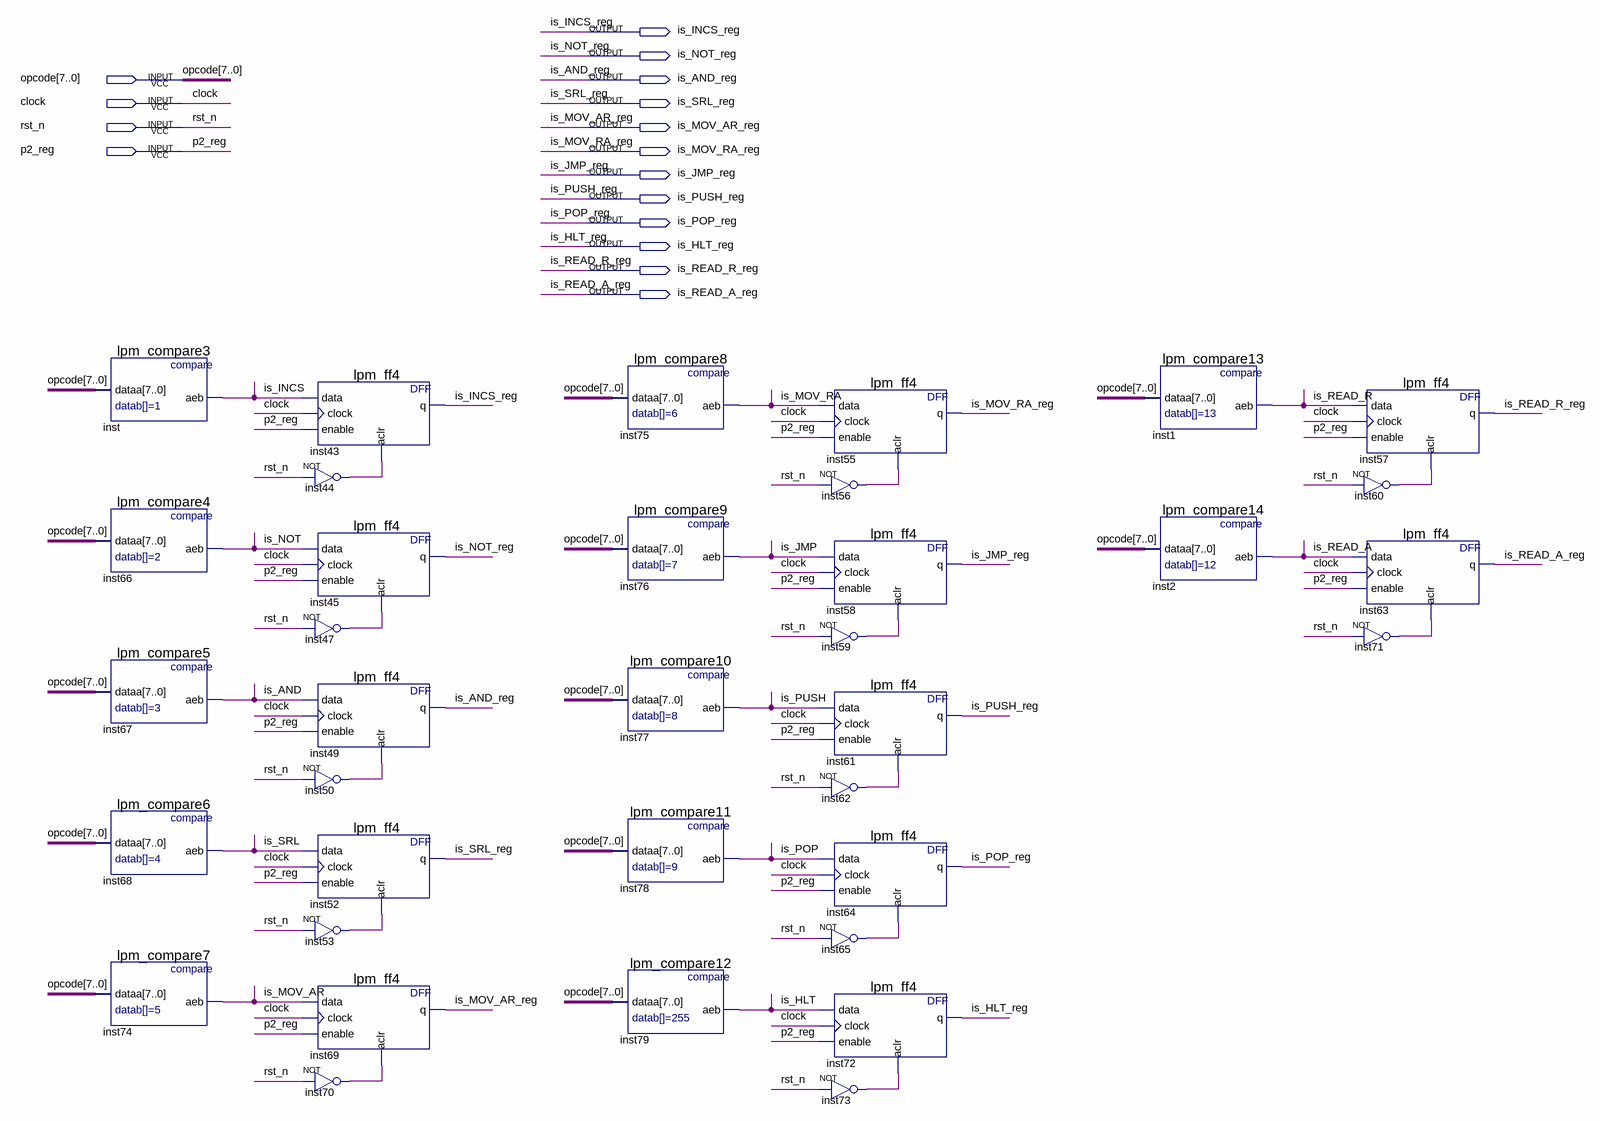
[diagram p0: schematic sheet]
// Quartus schematic cmd_decoder.bdf as structural Verilog: 36 symbols, 16 pins
module cmd_decoder (
  input  [7:0] opcode,
  input  clock,
  input  rst_n,
  input  p2_reg,
  output is_INCS_reg,
  output is_NOT_reg,
  output is_AND_reg,
  output is_SRL_reg,
  output is_MOV_AR_reg,
  output is_MOV_RA_reg,
  output is_JMP_reg,
  output is_PUSH_reg,
  output is_POP_reg,
  output is_HLT_reg,
  output is_READ_R_reg,
  output is_READ_A_reg
);

  wire inst44_out, inst47_out, inst50_out, inst53_out, inst56_out, inst59_out, inst60_out, inst62_out,
       inst65_out, inst70_out, inst71_out, inst73_out, is_AND, is_HLT, is_INCS, is_JMP, is_MOV_AR, is_MOV_RA,
       is_NOT, is_POP, is_PUSH, is_READ_A, is_READ_R, is_SRL;

  lpm_compare3 inst (.dataa(opcode), .aeb(is_INCS));
  lpm_compare4 inst66 (.dataa(opcode), .aeb(is_NOT));
  lpm_compare5 inst67 (.dataa(opcode), .aeb(is_AND));
  lpm_compare6 inst68 (.dataa(opcode), .aeb(is_SRL));
  lpm_compare7 inst74 (.dataa(opcode), .aeb(is_MOV_AR));
  lpm_ff4 inst43 (.data(is_INCS), .clock(clock), .enable(p2_reg), .aclr(inst44_out), .q(is_INCS_reg));
  not inst44 (inst44_out, rst_n);
  lpm_ff4 inst45 (.data(is_NOT), .clock(clock), .enable(p2_reg), .aclr(inst47_out), .q(is_NOT_reg));
  not inst47 (inst47_out, rst_n);
  lpm_ff4 inst49 (.data(is_AND), .clock(clock), .enable(p2_reg), .aclr(inst50_out), .q(is_AND_reg));
  not inst50 (inst50_out, rst_n);
  lpm_ff4 inst52 (.data(is_SRL), .clock(clock), .enable(p2_reg), .aclr(inst53_out), .q(is_SRL_reg));
  not inst53 (inst53_out, rst_n);
  lpm_ff4 inst69 (.data(is_MOV_AR), .clock(clock), .enable(p2_reg), .aclr(inst70_out), .q(is_MOV_AR_reg));
  not inst70 (inst70_out, rst_n);
  lpm_compare8 inst75 (.dataa(opcode), .aeb(is_MOV_RA));
  lpm_compare9 inst76 (.dataa(opcode), .aeb(is_JMP));
  lpm_compare10 inst77 (.dataa(opcode), .aeb(is_PUSH));
  lpm_compare11 inst78 (.dataa(opcode), .aeb(is_POP));
  lpm_compare12 inst79 (.dataa(opcode), .aeb(is_HLT));
  lpm_ff4 inst55 (.data(is_MOV_RA), .clock(clock), .enable(p2_reg), .aclr(inst56_out), .q(is_MOV_RA_reg));
  not inst56 (inst56_out, rst_n);
  lpm_ff4 inst58 (.data(is_JMP), .clock(clock), .enable(p2_reg), .aclr(inst59_out), .q(is_JMP_reg));
  not inst59 (inst59_out, rst_n);
  lpm_ff4 inst61 (.data(is_PUSH), .clock(clock), .enable(p2_reg), .aclr(inst62_out), .q(is_PUSH_reg));
  not inst62 (inst62_out, rst_n);
  lpm_ff4 inst64 (.data(is_POP), .clock(clock), .enable(p2_reg), .aclr(inst65_out), .q(is_POP_reg));
  not inst65 (inst65_out, rst_n);
  lpm_ff4 inst72 (.data(is_HLT), .clock(clock), .enable(p2_reg), .aclr(inst73_out), .q(is_HLT_reg));
  not inst73 (inst73_out, rst_n);
  lpm_compare13 inst1 (.dataa(opcode), .aeb(is_READ_R));
  lpm_compare14 inst2 (.dataa(opcode), .aeb(is_READ_A));
  lpm_ff4 inst57 (.data(is_READ_R), .clock(clock), .enable(p2_reg), .aclr(inst60_out), .q(is_READ_R_reg));
  not inst60 (inst60_out, rst_n);
  lpm_ff4 inst63 (.data(is_READ_A), .clock(clock), .enable(p2_reg), .aclr(inst71_out), .q(is_READ_A_reg));
  not inst71 (inst71_out, rst_n);
endmodule
